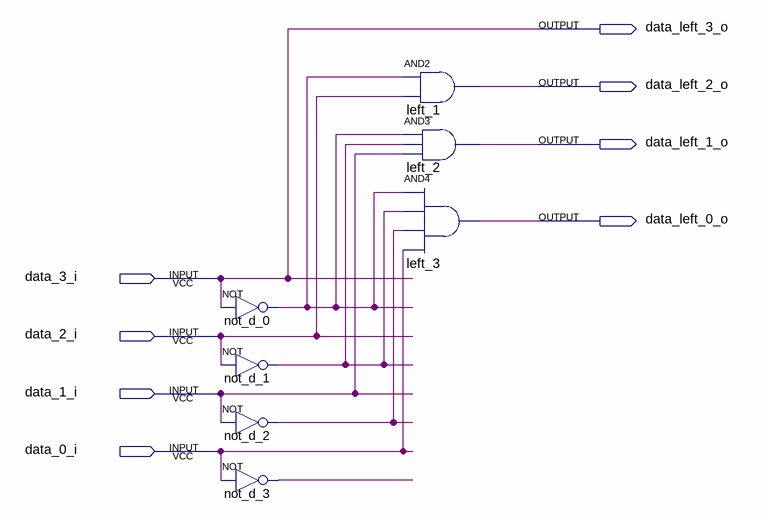
[diagram p0: schematic sheet]
// Quartus schematic priority_left_4.bdf as structural Verilog: 7 symbols, 8 pins
module priority_left_4 (
  input  data_3_i,
  input  data_2_i,
  input  data_1_i,
  input  data_0_i,
  output data_left_3_o,
  output data_left_2_o,
  output data_left_1_o,
  output data_left_0_o
);

  wire not_d_0_out, not_d_1_out, not_d_2_out, not_d_3_out;

  not not_d_0 (not_d_0_out, data_3_i);
  not not_d_1 (not_d_1_out, data_2_i);
  not not_d_2 (not_d_2_out, data_1_i);
  not not_d_3 (not_d_3_out, data_0_i);
  and left_1 (data_left_2_o, not_d_0_out, data_2_i);
  and left_2 (data_left_1_o, not_d_0_out, not_d_1_out, data_1_i);
  and left_3 (data_left_0_o, not_d_0_out, not_d_1_out, not_d_2_out, data_0_i);

  assign data_left_3_o = data_3_i;
endmodule
